# Altium schematic sheet NTP_Clock_stm32f107.SchDoc
size 444 x 304 mm; SheetNumber: 1; SheetTotal: 1
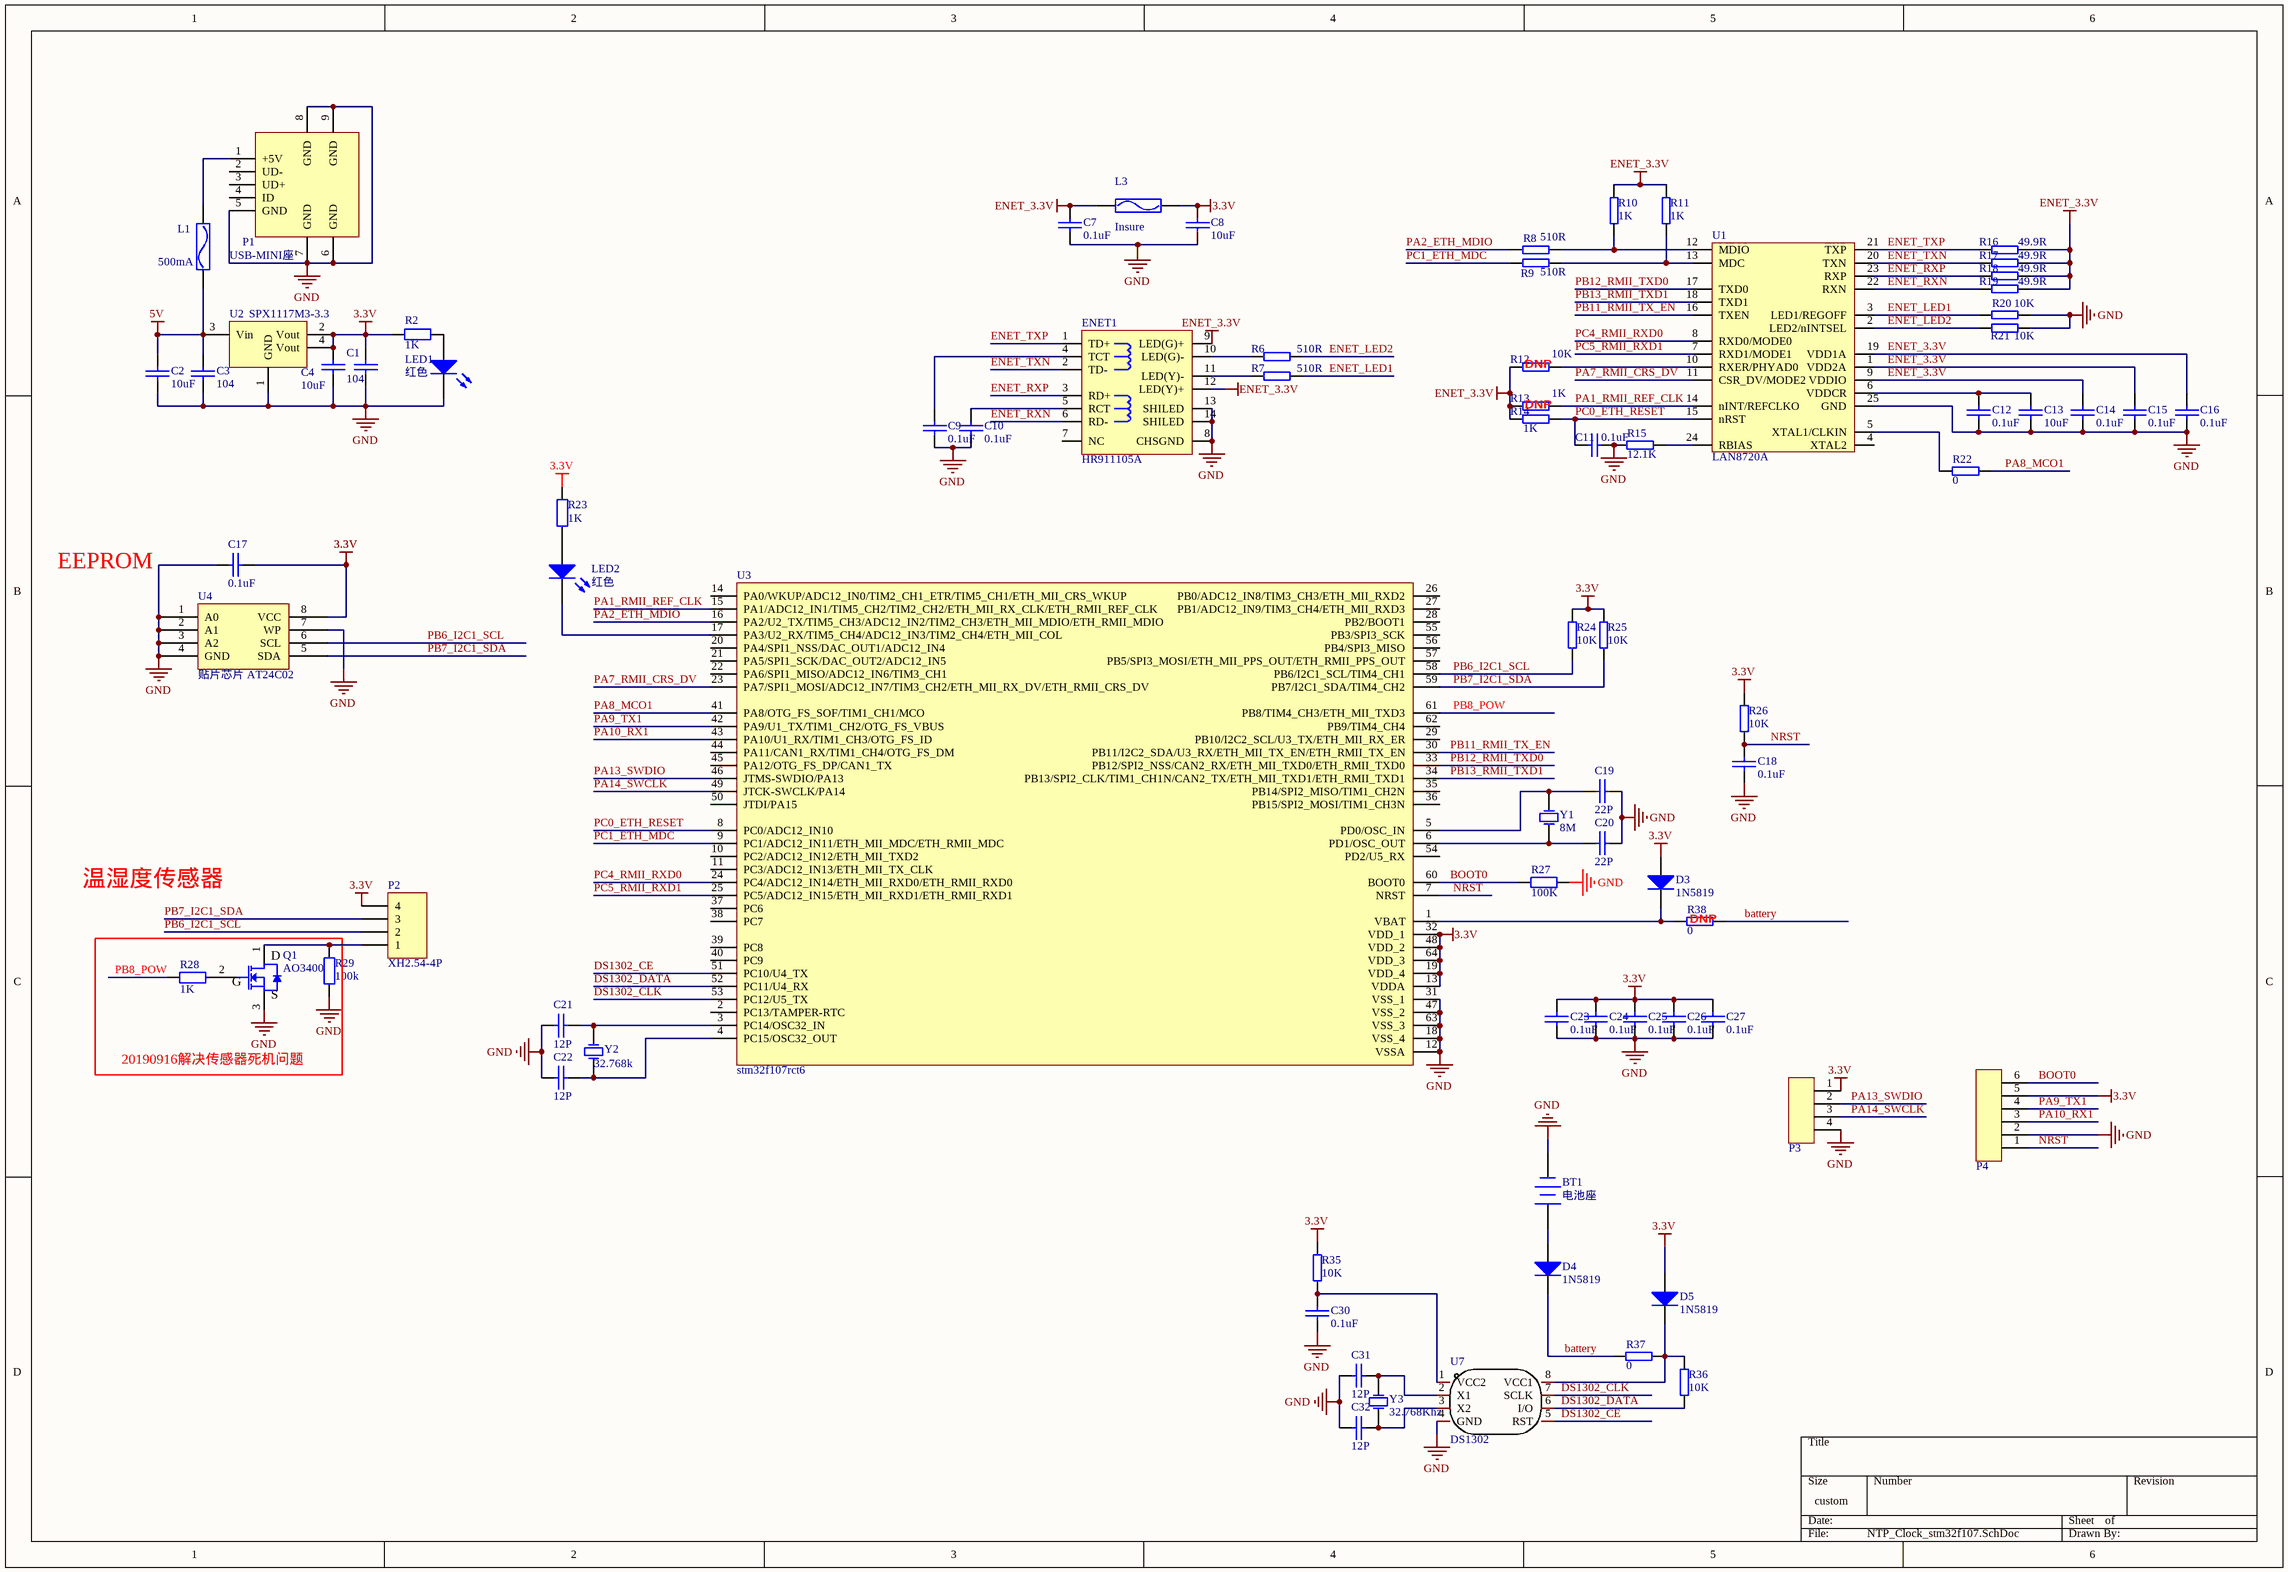
[diagram p0: NTP_Clock_stm32f107.SchDoc]

## Parts
BT1  电池座  [BAT-3V]
C1  104  [0805]
C2  10uF  [1206]
C3  104  [0805]
C4  10uF  [1206]
C7  0.1uF  [0805]
C8  10uF  [1206]
C9  0.1uF  [0805]
C10  0.1uF  [0805]
C11  0.1uF  [0805]
C12  0.1uF  [0805]
C13  10uF  [1206]
C14  0.1uF  [0805]
C15  0.1uF  [0805]
C16  0.1uF  [0805]
C17  0.1uF  [0805]
C18  0.1uF  [0805]
C19  22P  [0805]
C20  22P  [0805]
C21  12P  [0805]
C22  12P  [0805]
C23  0.1uF  [0805]
C24  0.1uF  [0805]
C25  0.1uF  [0805]
C26  0.1uF  [0805]
C27  0.1uF  [0805]
C30  0.1uF  [0805]
C31  12P  [0805]
C32  12P  [0805]
D3  1N5819  [二极管 贴片 IN4148]
D4  1N5819  [二极管 贴片 IN4148]
D5  1N5819  [二极管 贴片 IN4148]
ENET1  HR911105A  [RJ-45A12]
L1  500mA  [0805]
L3  Insure  [0805]
LED1  红色  [LED5_单色]
LED2  红色  [LED5_单色]
P1  USB-MINI座  [USB MINI DIP]
P2  XH2.54-4P  [CONN-SMD_HCZZ0021-4]
P3  2.54 1*4  [单排插针 2.54 1*4]  (value not drawn)
P4  2.54 1*6  [CONN-SMD_6P-P2.50_BX-HA2.54-6PWT]  (value not drawn)
Q1  AO3400  [sot23d]
R2  1K  [0805]
R6  510R  [0805]
R7  510R  [0805]
R8  510R  [0805]
R9  510R  [0805]
R10  1K  [0805]
R11  1K  [0805]
R12  10K  [0805]
R13  1K  [0805]
R14  1K  [0805]
R15  12.1K  [0805]
R16  49.9R  [0805]
R17  49.9R  [0805]
R18  49.9R  [0805]
R19  49.9R  [0805]
R20  10K  [0805]
R21  10K  [0805]
R22  0  [0805]
R23  1K  [0805]
R24  10K  [0805]
R25  10K  [0805]
R26  10K  [0805]
R27  100K  [0805]
R28  1K  [0805]
R29  100k  [0805]
R35  10K  [0805]
R36  10K  [0805]
R37  0  [0805]
R38  0  [0805]
U1  LAN8720A  [QFN24]
U2  SPX1117M3-3.3  [SOT223]
U3  stm32f107rct6  [stm32f107rct6]
U4  贴片芯片 AT24C02  [SOIC8]
U7  DS1302  [SOP-8_L4.9-W3.9-P1.27-LS6.0-BL]  (net tie, no BOM)
Y1  8M  [晶振 BCY-W2/E4.7_贴]
Y2  32.768k  [晶振 卧 8*2mm]
Y3  32.768Khz  [晶振 卧 8*2mm]

## Blocks framed on the sheet
20190916解决传感器死机问题: Q1 R28 R29

## Nets
3.3V: C1.1 C4.1 C8.2 C17.1 C23.2 C24.2 C25.2 C26.2 C27.2 D3.1(A) D5.1(A) L3.2 P2.4 P3.1 P4.5 R2.2 R23.1 R24.1 R25.1 R26.2 R35.2 U2.2(Vout) U2.4(Vout) U3.13(VDDA) U3.19(VDD_4) U3.32(VDD_1) U3.48(VDD_2) U3.64(VDD_3) U4.8(VCC)
5V: C2.1 C3.1 L1.1 U2.3(Vin)
ENET_3.3V: C7.2 C14.2 C15.2 C16.2 ENET1.9(LED(G)+) ENET1.12(LED(Y)+) L3.1 R10.1 R11.1 R12.2 R13.2 R14.2 R16.1 R17.1 R18.1 R19.1 U1.1(VDD2A) U1.9(VDDIO) U1.19(VDD1A)
GND: BT1.2(-) C1.2 C2.2 C3.2 C4.2 C7.1 C8.1 C9.1 C10.1 C11.2 C12.1 C13.1 C14.1 C15.1 C16.1 C17.2 C18.2 C19.2 C20.2 C21.1 C22.1 C23.1 C24.1 C25.1 C26.1 C27.1 C30.2 C31.1 C32.1 ENET1.8(CHSGND) ENET1.13(SHILED) ENET1.14(SHILED) LED1.2(K) P1.5(GND) P1.6(GND) P1.7(GND) P1.8(GND) P1.9(GND) P3.4 P4.2 Q1.3(S) R15.2 R20.1 R21.1 R27.1 R29.2 U1.25(GND) U2.1(GND) U3.12(VSSA) U3.18(VSS_4) U3.31(VSS_1) U3.47(VSS_2) U3.63(VSS_3) U4.1(A0) U4.2(A1) U4.3(A2) U4.4(GND) U4.7(WP) U7.4(GND)
battery: D4.2(K) R37.2 R38.1
BOOT0: P4.6 R27.2 U3.60(BOOT0)
DS1302_CE: U3.51(PC10/U4_TX) U7.5(RST)
DS1302_CLK: U3.53(PC12/U5_TX) U7.7(SCLK)
DS1302_DATA: R36.2 U3.52(PC11/U4_RX) U7.6(I/O)
ENET_LED1: R7.1 R20.2 U1.3(LED1/REGOFF)
ENET_LED2: R6.1 R21.2 U1.2(LED2/nINTSEL)
ENET_RXN: ENET1.6(RD-) R19.2 U1.22(RXN)
ENET_RXP: ENET1.3(RD+) R18.2 U1.23(RXP)
ENET_TXN: ENET1.2(TD-) R17.2 U1.20(TXN)
ENET_TXP: ENET1.1(TD+) R16.2 U1.21(TXP)
NRST: C18.1 P4.1 R26.1 U3.7(NRST)
PA1_RMII_REF_CLK: R13.1 U1.14(nINT/REFCLKO) U3.15(PA1/ADC12_IN1/TIM5_CH2/TIM2_CH2/ETH_MII_RX_CLK/ETH_RMII_REF_CLK)
PA2_ETH_MDIO: R8.2 U3.16(PA2/U2_TX/TIM5_CH3/ADC12_IN2/TIM2_CH3/ETH_MII_MDIO/ETH_RMII_MDIO)
PA7_RMII_CRS_DV: U1.11(CSR_DV/MODE2) U3.23(PA7/SPI1_MOSI/ADC12_IN7/TIM3_CH2/ETH_MII_RX_DV/ETH_RMII_CRS_DV)
PA8_MCO1: R22.1 U3.41(PA8/OTG_FS_SOF/TIM1_CH1/MCO)
PA9_TX1: P4.4 U3.42(PA9/U1_TX/TIM1_CH2/OTG_FS_VBUS)
PA10_RX1: P4.3 U3.43(PA10/U1_RX/TIM1_CH3/OTG_FS_ID)
PA13_SWDIO: P3.2 U3.46(JTMS-SWDIO/PA13)
PA14_SWCLK: P3.3 U3.49(JTCK-SWCLK/PA14)
PB6_I2C1_SCL: P2.2 R24.2 U3.58(PB6/I2C1_SCL/TIM4_CH1) U4.6(SCL)
PB7_I2C1_SDA: P2.3 R25.2 U3.59(PB7/I2C1_SDA/TIM4_CH2) U4.5(SDA)
PB8_POW: R28.2 U3.61(PB8/TIM4_CH3/ETH_MII_TXD3)
PB11_RMII_TX_EN: U1.16(TXEN) U3.30(PB11/I2C2_SDA/U3_RX/ETH_MII_TX_EN/ETH_RMII_TX_EN)
PB12_RMII_TXD0: U1.17(TXD0) U3.33(PB12/SPI2_NSS/CAN2_RX/ETH_MII_TXD0/ETH_RMII_TXD0)
PB13_RMII_TXD1: U1.18(TXD1) U3.34(PB13/SPI2_CLK/TIM1_CH1N/CAN2_TX/ETH_MII_TXD1/ETH_RMII_TXD1)
PC0_ETH_RESET: C11.1 R14.1 U1.15(nRST) U3.8(PC0/ADC12_IN10)
PC1_ETH_MDC: R9.2 U3.9(PC1/ADC12_IN11/ETH_MII_MDC/ETH_RMII_MDC)
PC4_RMII_RXD0: U1.8(RXD0/MODE0) U3.24(PC4/ADC12_IN14/ETH_MII_RXD0/ETH_RMII_RXD0)
PC5_RMII_RXD1: U1.7(RXD1/MODE1) U3.25(PC5/ADC12_IN15/ETH_MII_RXD1/ETH_RMII_RXD1)
NetBT1_1: BT1.1(+) D4.1(A)
NetC9_2: C9.2 ENET1.4(TCT)
NetC10_2: C10.2 ENET1.5(RCT)
NetC12_2: C12.2 C13.2 U1.6(VDDCR)
NetC19_1: C19.1 U3.5(PD0/OSC_IN) Y1.2(OSC2)
NetC20_1: C20.1 U3.6(PD1/OSC_OUT) Y1.1(OSC1)
NetC21_2: C21.2 U3.3(PC14/OSC32_IN) Y2.1(OSC1)
NetC22_2: C22.2 U3.4(PC15/OSC32_OUT) Y2.2(OSC2)
NetC30_1: C30.1 R35.1 U7.1(VCC2)
NetC31_2: C31.2 U7.2(X1) Y3.1(OSC1)
NetC32_2: C32.2 U7.3(X2) Y3.2(OSC2)
NetD3_2: D3.2(K) R38.2 U3.1(VBAT)
NetD5_2: D5.2(K) R36.1 R37.1 U7.8(VCC1)
NetENET1_10: ENET1.10(LED(G)-) R6.2
NetENET1_11: ENET1.11(LED(Y)-) R7.2
NetL1_2: L1.2 P1.1(+5V)
NetLED1_1: LED1.1(A) R2.1
NetLED2_1: LED2.1(A) R23.2
NetLED2_2: LED2.2(K) U3.17(PA3/U2_RX/TIM5_CH4/ADC12_IN3/TIM2_CH4/ETH_MII_COL)
NetP2_1: P2.1 Q1.1(D) R29.1
NetQ1_2: Q1.2(G) R28.1
NetR8_1: R8.1 R10.2 U1.12(MDIO)
NetR9_1: R9.1 R11.2 U1.13(MDC)
NetR12_1: R12.1 U1.10(RXER/PHYAD0)
NetR15_1: R15.1 U1.24(RBIAS)
NetR22_2: R22.2 U1.5(XTAL1/CLKIN)

Not connected (* = marked no-connect by the designer): ENET1 7(NC); P1 2(UD-) 3(UD+) 4(ID); U1 4(XTAL2); U3 2(PC13/TAMPER-RTC) 10(PC2/ADC12_IN12/ETH_MII_TXD2) 11(PC3/ADC12_IN13/ETH_MII_TX_CLK) 14(PA0/WKUP/ADC12_IN0/TIM2_CH1_ETR/TIM5_CH1/ETH_MII_CRS_WKUP) 20(PA4/SPI1_NSS/DAC_OUT1/ADC12_IN4) 21(PA5/SPI1_SCK/DAC_OUT2/ADC12_IN5) 22(PA6/SPI1_MISO/ADC12_IN6/TIM3_CH1) 26(PB0/ADC12_IN8/TIM3_CH3/ETH_MII_RXD2) 27(PB1/ADC12_IN9/TIM3_CH4/ETH_MII_RXD3) 28(PB2/BOOT1) 29(PB10/I2C2_SCL/U3_TX/ETH_MII_RX_ER) 35(PB14/SPI2_MISO/TIM1_CH2N) 36(PB15/SPI2_MOSI/TIM1_CH3N) 37(PC6) 38(PC7) 39(PC8) 40(PC9) 44(PA11/CAN1_RX/TIM1_CH4/OTG_FS_DM) 45(PA12/OTG_FS_DP/CAN1_TX) 50(JTDI/PA15) 54(PD2/U5_RX) 55(PB3/SPI3_SCK) 56(PB4/SPI3_MISO) 57(PB5/SPI3_MOSI/ETH_MII_PPS_OUT/ETH_RMII_PPS_OUT) 62(PB9/TIM4_CH4)

## Notes on the sheet
- (near R12) DNP
- (near R13) DNP
- EEPROM
- 温湿度传感器
- (near R38) DNP

## Library data of the parts
C1 C3 = 贴片电容 0805: 名称: 贴片电容; 单位: 个; 封装: 0805
C2 C4 = 贴片电容 0805: 名称: 贴片电容; 封装: 0805; 单位: 个
C7 C9-C12 C14-C27 C30-C32 = 电容 贴片: 名称: 贴片电容; 单位: 个; 封装: 0805
C8 C13 = 电容 贴片: 名称: 贴片电容; 封装: 0805; 单位: 个
D3-D5 = 二极管 贴片 1N4148: 名称: 贴片二极管; 封装: 贴片; 单位: 个
ENET1 = HR911105A: 带灯以太网接口; 版权归属: 源创客; BOM名称: 带灯以太网接口; 学习资源: www.ooocke.com
L1 = 保险_自恢复: 单位: 个; 名称: 自恢复保险管; 封装: 0805
L3 = 保险 自恢复: 单位: 个; 名称: 自恢复保险管; 封装: 0805
LED1 LED2 = 发光二极管 Φ3: D_RED_D; 名称: 发光二极管; 封装: Φ3; 单位: 个
P1 = 联结件 USB-MINI座: 单位: 个; 封装: 440068; 名称: 联结件
P2 = 联结件 XH2.54-4: 名称: 联结件; 单位: 套; 封装: XH2.54-4
P3 = 连接件 单排插针 2.54 1*4: 单位: 片; 封装: DIP; 名称: 单排插针
P4 = 连接件 单排插针 2.54 1*6: 单位: 片; 封装: DIP; 名称: 单排插针
Q1 = MOS管 AO3400: 单位: 个; 名称: N沟道MOS; 封装: TO-220
R2 R23 R27 = 贴片电阻 0805: 名称: 贴片电阻; 单位: 个; 封装: 0805
R6-R22 R24-R26 R35-R38 = 电阻 贴片: 名称: 贴片电阻; 单位: 个; 封装: 0805
R28 R29 = 贴片电阻 0603: 名称: 贴片电阻; 封装: 0603; 单位: 个
U1 = LAN8720: ETH PHY
U2 = 贴片芯片 SPX1117M3-5.0: 名称: 贴片芯片; 单位: 个; 封装: SOT223
U4 = 贴片芯片 AT24C02: 单位: 片; 封装: SOIC4; 名称: 贴片芯片
U7 = DS1302: 工业级 具有涓细电流充电能力的低功耗实时时钟芯片; Manufacturer: HGSEMI(华冠); Symbol: DS1302ZM; Add into BOM: yes; Device: DS1302ZM; LCSC Part Name: DS1302ZM; Supplier Part: C910859; Manufacturer Part: DS1302ZM; Supplier Footprint: SOP-8; JLCPCB Part Class: Extended Part; Supplier: LCSC; Convert to PCB: yes; Name: DS1302
Y1 Y2 = 晶振 直插矮: 名称: 晶振; 封装: 直插矮; 单位: 个
Y3 = 晶振 直插: 名称: 晶振; 封装: 直插矮; 单位: 个
BT1 = 电池座: Published: 24-Mar-1999; LatestRevisionDate: 17-Jul-2002; LatestRevisionNote: Re-released for DXP Platform.; PackageReference: BAT-2; Publisher: Altium Limited